# EAGLE design V1c (EAGLE 6.5.0)
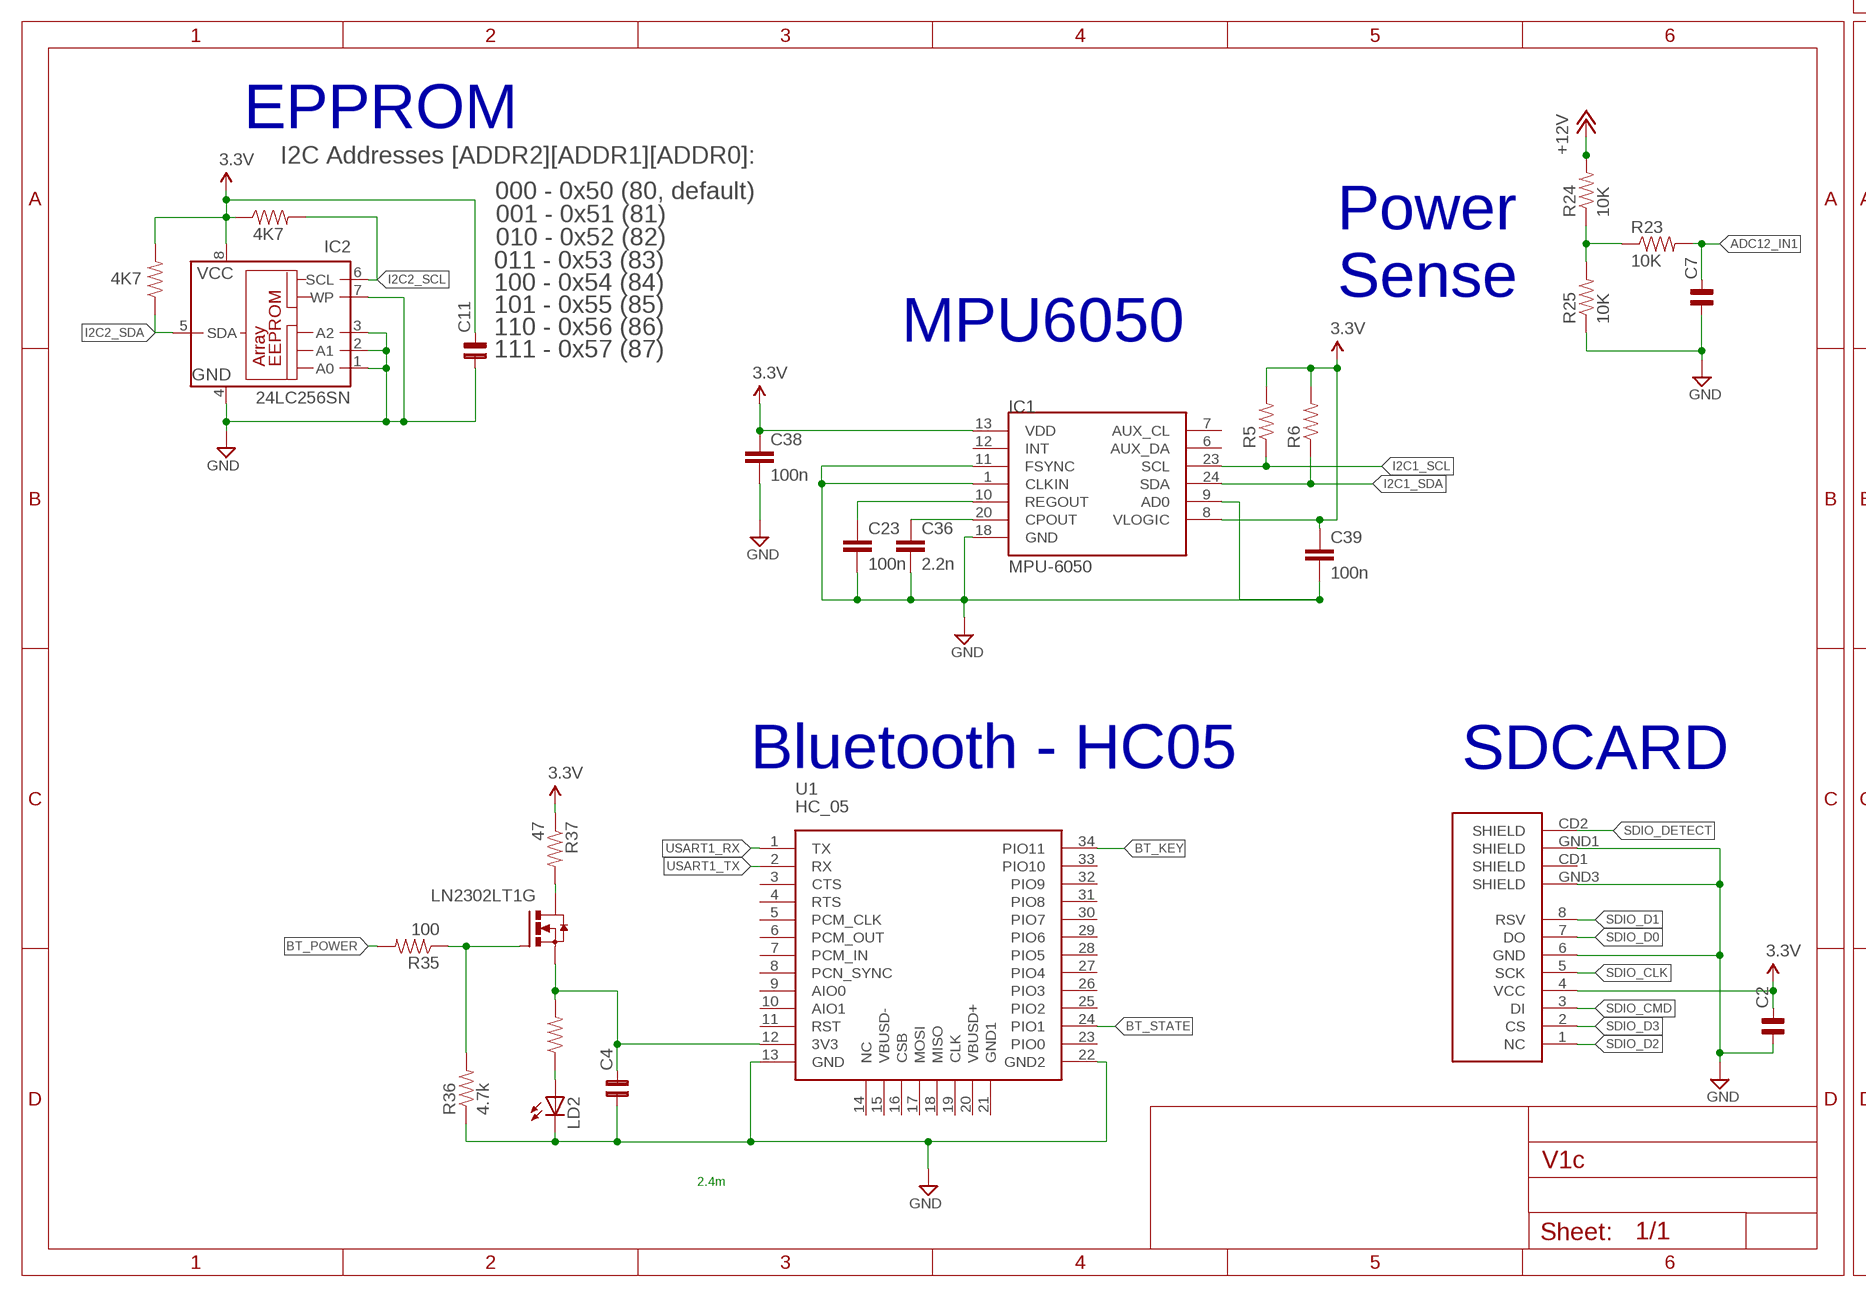
[diagram p0: schematic, sheet 1, part 1 of 2]
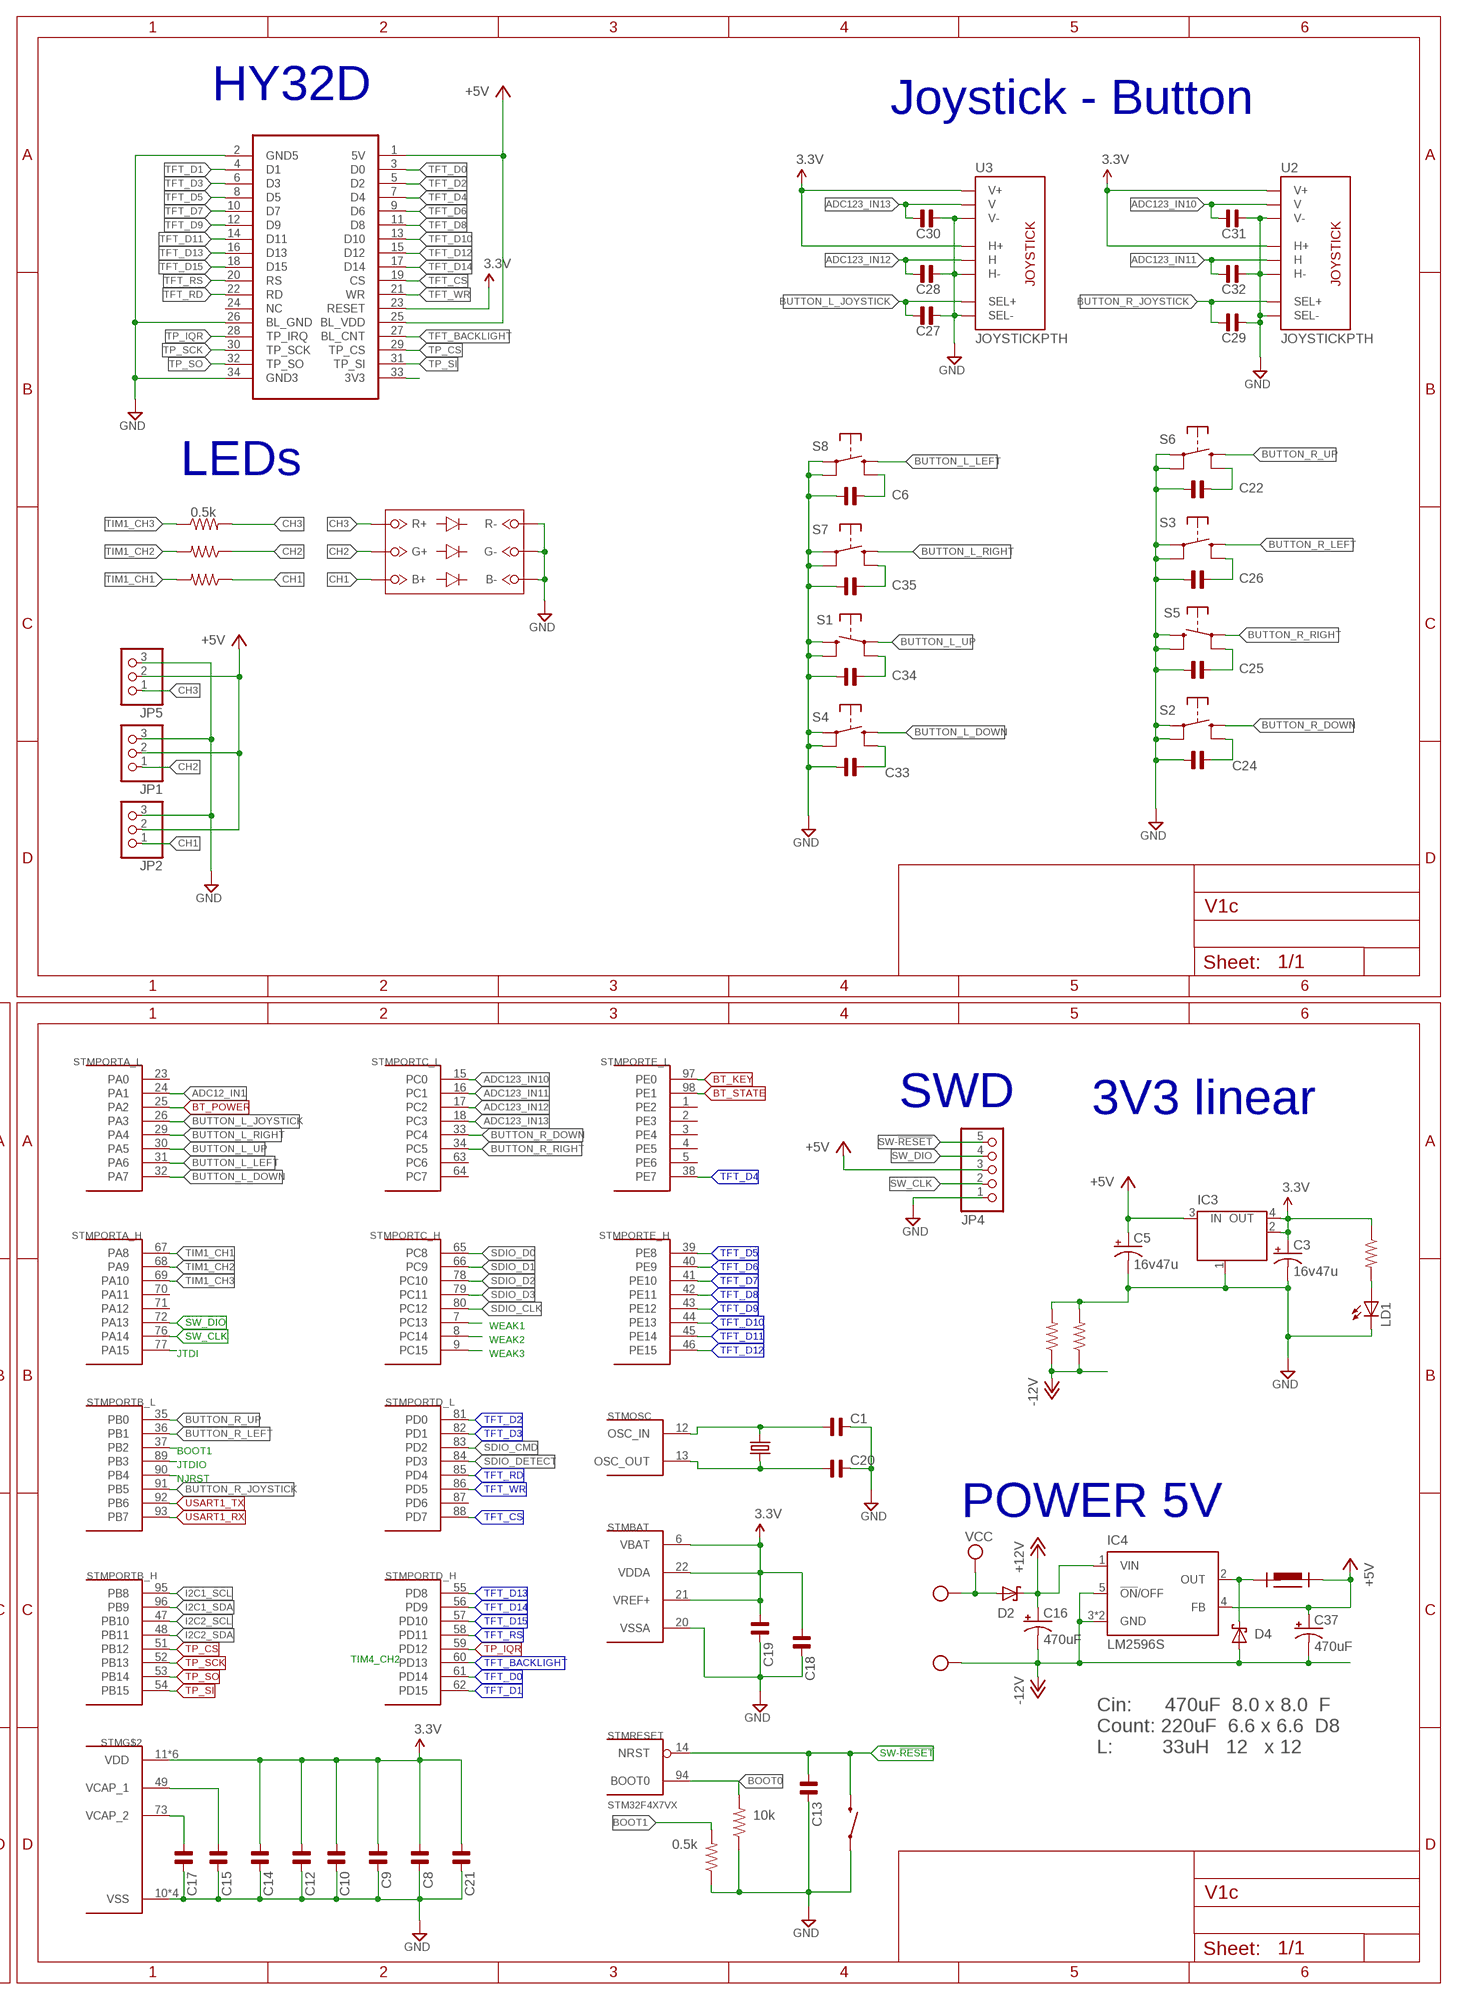
[diagram p1: schematic, sheet 1, part 2 of 2]

## Parts
C1  C-NP-SMD-0603  [C-0603]
C2  C-NP-SMD-0603  [C-0603]
C3  16v47u  CPOL-USSMCC  [SMC_C]
C4  C-NP-SMD-0603  [C-0603]
C5  16v47u  CPOL-USSMCC  [SMC_C]
C6  C-NP-SMD-0603  [C-0603]
C7  C-NP-SMD-0603  [C-0603]
C8  C-NP-SMD-0603  [C-0603]
C9  C-NP-SMD-0603  [C-0603]
C10  C-NP-SMD-0603  [C-0603]
C11  C-NP-SMD-0603  [C-0603]
C12  C-NP-SMD-0603  [C-0603]
C13  C-NP-SMD-0603  [C-0603]
C14  C-NP-SMD-0603  [C-0603]
C15  C-NP-SMD-0603  [C-0603]
C16  470uF  CPOL-US175TMP-0808  [175TMP-0808]
C17  C-NP-SMD-0603  [C-0603]
C18  C-NP-SMD-0603  [C-0603]
C19  C-NP-SMD-0603  [C-0603]
C20  C-NP-SMD-0603  [C-0603]
C21  C-NP-SMD-0603  [C-0603]
C22  C-NP-SMD-0603  [C-0603]
C23  100n  SPARKFUN_CAP0603-CAP  [SPARKFUN_0603-CAP]
C24  C-NP-SMD-0603  [C-0603]
C25  C-NP-SMD-0603  [C-0603]
C26  C-NP-SMD-0603  [C-0603]
C27  C-NP-SMD-0603  [C-0603]
C28  C-NP-SMD-0603  [C-0603]
C29  C-NP-SMD-0603  [C-0603]
C30  C-NP-SMD-0603  [C-0603]
C31  C-NP-SMD-0603  [C-0603]
C32  C-NP-SMD-0603  [C-0603]
C33  C-NP-SMD-0603  [C-0603]
C34  C-NP-SMD-0603  [C-0603]
C35  C-NP-SMD-0603  [C-0603]
C36  2.2n  SPARKFUN_CAP0603-CAP  [SPARKFUN_0603-CAP]
C37  470uF  CPOL-USE/7260-38W  [E/7260-38W]
C38  100n  SPARKFUN_CAP0603-CAP  [SPARKFUN_0603-CAP]
C39  100n  SPARKFUN_CAP0603-CAP  [SPARKFUN_0603-CAP]
D2  MBRS330T3  [SMC]
D4  MBRS330T3  [SMC]
IC1  MPU-6050  TESTING_MPU-6050-1  [TESTING_QFN-24-4MM2]
IC2  24LC256SN  [SO-08]
IC3  LINEAR_MC33269ST-3.3T3  [LINEAR_SOT223]
IC4  LM2596S  [TO263-5]
JP1  PINHD-1X3_2.54-90°  [1X03/90]
JP2  PINHD-1X3_2.54-90°  [1X03/90]
JP4  PINHD-1X5_2.54-90°  [1X05/90]
JP5  PINHD-1X3_2.54-90°  [1X03/90]
LD1  LEDCHIPLED_0805  [CHIPLED_0805]
LD2  LEDCHIPLED_0805  [CHIPLED_0805]
LN2302LT1G  FDN327N  [SOT-23]
R1  10k  SPARKFUN_RESISTOR0603-RES  [SPARKFUN_0603-RES]
R2  10k  SPARKFUN_RESISTOR0603-RES  [SPARKFUN_0603-RES]
R5  SPARKFUN_RESISTOR0603-RES  [SPARKFUN_0603-RES]
R6  SPARKFUN_RESISTOR0603-RES  [SPARKFUN_0603-RES]
R7  10k  SPARKFUN_RESISTOR0603-RES  [SPARKFUN_0603-RES]
R8  0.5k  SPARKFUN_RESISTOR0603-RES  [SPARKFUN_0603-RES]
R9  10K  SPARKFUN_RESISTOR0603-RES  [SPARKFUN_0603-RES]
R10  10K  SPARKFUN_RESISTOR0603-RES  [SPARKFUN_0603-RES]
R11  10K  SPARKFUN_RESISTOR0603-RES  [SPARKFUN_0603-RES]
R12  10K  SPARKFUN_RESISTOR0603-RES  [SPARKFUN_0603-RES]
R15  4K7  SPARKFUN_RESISTOR0603-RES  [SPARKFUN_0603-RES]
R16  4K7  SPARKFUN_RESISTOR0603-RES  [SPARKFUN_0603-RES]
R23  10K  SPARKFUN_RESISTOR0603-RES  [SPARKFUN_0603-RES]
R24  10K  SPARKFUN_RESISTOR0603-RES  [SPARKFUN_0603-RES]
R25  10K  SPARKFUN_RESISTOR0603-RES  [SPARKFUN_0603-RES]
R35  100  SPARKFUN_RESISTOR0603-RES  [SPARKFUN_0603-RES]
R36  4.7k  SPARKFUN_RESISTOR0603-RES  [SPARKFUN_0603-RES]
R37  47  SPARKFUN_RESISTOR0603-RES  [SPARKFUN_0603-RES]
R39  10K  SPARKFUN_RESISTOR0603-RES  [SPARKFUN_0603-RES]
S1  RACON12/  [RACON12/]
S2  RACON12/  [RACON12/]
S3  RACON12/  [RACON12/]
S4  RACON12/  [RACON12/]
S5  RACON12/  [RACON12/]
S6  RACON12/  [RACON12/]
S7  RACON12/  [RACON12/]
S8  RACON12/  [RACON12/]
S9  RESET  SWITCH-MOMENTARY-2-SMD-1101NE  [TACTILE-SWITCH-1101NE]
SDCARD2  microSD Socket  USD-SOCKETNEW  [MICRO-SD-SOCKET-PP]
STM  STM32F4X7VX  [TQFP100]
U1  HC_05  [BLUETOOTH_SMD]
U2  JOYSTICKPTH  [JOYSTICK]
U3  JOYSTICKPTH  [JOYSTICK]
U$3  TFT3.2  [HY32D_2]
U$5  BIG_INDUCTOR  [12X12]
U$13  RGB_LED  [SMD]
X1  MKDSN1,5/2-5,08  [MKDSN1,5/2-5,08]
Y1  CRYSTALHC49US  [HC49US]

## Nets
3.3V: C2.2 C3.+ C8.1 C9.1 C10.1 C11.2 C12.1 C14.1 C18.1 C19.1 C21.1 C38.1 C39.1 IC1.8(VLOGIC) IC1.13(VDD) IC2.8(VCC) IC3.2(OUT) IC3.4(OUT) R5.2 R6.2 R9.1 R15.1 R16.2 R37.1 SDCARD2.4(VCC) STM.6(BAT:VBAT) STM.11(VDD) STM.19(VDD) STM.21(BAT:VREF+) STM.22(BAT:VDDA) STM.28(VDD) STM.50(VDD) STM.75(VDD) STM.100(VDD) U2.H1(H+) U2.V1(V+) U3.H1(H+) U3.V1(V+) U$3.23(RESET)
+5V: C5.+ C37.+ IC3.3(IN) IC4.4(FB) JP1.2 JP2.2 JP4.3 JP5.2 U$3.1(5V) U$3.25(BL_VDD) U$5.P$1
+12V: C16.+ D2.C IC4.1(VIN) R24.2
-12V: C16.- C37.- D4.A IC4.3(GND) IC4.5(!ON!/OFF) IC4.6(GND) R1.1 R2.1 X1.1
ADC12_IN1: C7.2 R23.2 STM.24(PORTA_L:PA1)
ADC123_IN10: C31.1 STM.15(PORTC_L:PC0) U2.V2(V)
ADC123_IN11: C32.1 STM.16(PORTC_L:PC1) U2.H2(H)
ADC123_IN12: C28.1 STM.17(PORTC_L:PC2) U3.H2(H)
ADC123_IN13: C30.1 STM.18(PORTC_L:PC3) U3.V2(V)
BOOT0: R7.2 STM.94(RESET:BOOT0)
BOOT1: R8.2 STM.37(PORTB_L:PB2)
BT_KEY: STM.97(PORTE_L:PE0) U1.34(PIO11)
BT_POWER: R35.2 STM.25(PORTA_L:PA2)
BT_STATE: STM.98(PORTE_L:PE1) U1.24(PIO1)
BUTTON_L_DOWN: S4.1(S) STM.32(PORTA_L:PA7)
BUTTON_L_JOYSTICK: C27.1 STM.26(PORTA_L:PA3) U3.B1A(SEL+)
BUTTON_L_LEFT: S8.1(S) STM.31(PORTA_L:PA6)
BUTTON_L_RIGHT: S7.1(S) STM.29(PORTA_L:PA4)
BUTTON_L_UP: S1.3(P) STM.30(PORTA_L:PA5)
BUTTON_R_DOWN: S2.1(S) STM.33(PORTC_L:PC4)
BUTTON_R_JOYSTICK: C29.1 STM.91(PORTB_L:PB5) U2.B1A(SEL+)
BUTTON_R_LEFT: S3.1(S) STM.36(PORTB_L:PB1)
BUTTON_R_RIGHT: S5.3(P) STM.34(PORTC_L:PC5)
BUTTON_R_UP: S6.1(S) STM.35(PORTB_L:PB0)
CH1: JP2.1 R11.1 U$13.B+
CH2: JP1.1 R39.1 U$13.G+
CH3: JP5.1 R12.2 U$13.R+
GND: C1.2 C2.1 C3.- C4.1 C5.- C6.1 C7.1 C8.2 C9.2 C10.2 C11.1 C12.2 C13.2 C14.2 C15.2 C17.2 C18.2 C19.2 C20.2 C21.2 C22.1 C23.2 C24.2 C25.2 C26.2 C27.2 C28.2 C29.2 C30.2 C31.2 C32.2 C33.2 C34.2 C35.2 C36.2 C38.2 C39.2 IC1.1(CLKIN) IC1.9(AD0) IC1.11(FSYNC) IC1.18(GND) IC2.1(A0) IC2.2(A1) IC2.3(A2) IC2.4(GND) IC2.7(WP) IC3.1(GND/ADJ) JP1.3 JP2.3 JP4.1 JP5.3 LD1.C LD2.C R1.2 R2.2 R7.1 R8.1 R25.1 R36.1 S1.1(S) S1.2(S) S2.3(P) S2.4(P) S3.3(P) S3.4(P) S4.3(P) S4.4(P) S5.1(S) S5.2(S) S6.3(P) S6.4(P) S7.3(P) S7.4(P) S8.3(P) S8.4(P) S9.P$1 SDCARD2.6(GND) SDCARD2.GND1(SHIELD) SDCARD2.GND3(SHIELD) STM.10(VSS) STM.20(BAT:VSSA) STM.27(VSS) STM.74(VSS) STM.99(VSS) U1.13(GND) U1.22(GND2) U2.B2A(SEL-) U2.H3(H-) U2.V3(V-) U3.B2A(SEL-) U3.H3(H-) U3.V3(V-) U$3.2(GND5) U$3.26(BL_GND) U$3.34(GND3) U$13.B- U$13.G- U$13.R-
I2C1_SCL: IC1.23(SCL) R5.1 STM.95(PORTB_H:PB8)
I2C1_SDA: IC1.24(SDA) R6.1 STM.96(PORTB_H:PB9)
I2C2_SCL: IC2.6(SCL) R15.2 STM.47(PORTB_H:PB10)
I2C2_SDA: IC2.5(SDA) R16.1 STM.48(PORTB_H:PB11)
JTDI: STM.77(PORTA_H:PA15)
JTDIO: STM.89(PORTB_L:PB3)
N$1: C1.1 STM.12(OSC:OSC_IN) Y1.2
N$2: C6.2 S8.2(S)
N$3: C23.1 IC1.10(REGOUT)
N$4: C36.1 IC1.20(CPOUT)
N$5: C22.2 S6.2(S)
N$6: C35.1 S7.2(S)
N$7: C25.1 S5.4(P)
N$8: C4.2 LN2302LT1G.2(S) R10.2 U1.12(3V3)
N$9: C24.1 S2.2(S)
N$10: C26.1 S3.2(S)
N$11: LN2302LT1G.3(D) R37.2
N$12: C34.1 S1.4(P)
N$13: C33.1 S4.2(S)
N$14: LD1.A R9.2
N$15: LD2.A R10.1
N$27: R23.1 R24.1 R25.2
N$29: C20.1 STM.13(OSC:OSC_OUT) Y1.1
N$30: U$3.33(3V3)
N$31: C17.1 STM.73(VCAP_2)
N$32: C15.1 STM.49(VCAP_1)
N$34: LN2302LT1G.1(G) R35.1 R36.2
NJRST: STM.90(PORTB_L:PB4)
OUT1: D4.C IC4.2(OUT) U$5.P$2
SDIO_CLK: SDCARD2.5(SCK) STM.80(PORTC_H:PC12)
SDIO_CMD: SDCARD2.3(DI) STM.83(PORTD_L:PD2)
SDIO_D0: SDCARD2.7(DO) STM.65(PORTC_H:PC8)
SDIO_D1: SDCARD2.8(RSV) STM.66(PORTC_H:PC9)
SDIO_D2: SDCARD2.1(NC) STM.78(PORTC_H:PC10)
SDIO_D3: SDCARD2.2(CS) STM.79(PORTC_H:PC11)
SDIO_DETECT: SDCARD2.CD2(SHIELD) STM.84(PORTD_L:PD3)
SW-!RESET: C13.1 JP4.5 S9.P$2 STM.14(RESET:NRST)
SW_CLK: JP4.2 STM.76(PORTA_H:PA14)
SW_DIO: JP4.4 STM.72(PORTA_H:PA13)
TFT_BACKLIGHT: STM.60(PORTD_H:PD13) U$3.27(BL_CNT)
TFT_CS: STM.88(PORTD_L:PD7) U$3.19(CS)
TFT_D0: STM.61(PORTD_H:PD14) U$3.3(D0)
TFT_D1: STM.62(PORTD_H:PD15) U$3.4(D1)
TFT_D2: STM.81(PORTD_L:PD0) U$3.5(D2)
TFT_D3: STM.82(PORTD_L:PD1) U$3.6(D3)
TFT_D4: STM.38(PORTE_L:PE7) U$3.7(D4)
TFT_D5: STM.39(PORTE_H:PE8) U$3.8(D5)
TFT_D6: STM.40(PORTE_H:PE9) U$3.9(D6)
TFT_D7: STM.41(PORTE_H:PE10) U$3.10(D7)
TFT_D8: STM.42(PORTE_H:PE11) U$3.11(D8)
TFT_D9: STM.43(PORTE_H:PE12) U$3.12(D9)
TFT_D10: STM.44(PORTE_H:PE13) U$3.13(D10)
TFT_D11: STM.45(PORTE_H:PE14) U$3.14(D11)
TFT_D12: STM.46(PORTE_H:PE15) U$3.15(D12)
TFT_D13: STM.55(PORTD_H:PD8) U$3.16(D13)
TFT_D14: STM.56(PORTD_H:PD9) U$3.17(D14)
TFT_D15: STM.57(PORTD_H:PD10) U$3.18(D15)
TFT_RD: STM.85(PORTD_L:PD4) U$3.22(RD)
TFT_RS: STM.58(PORTD_H:PD11) U$3.20(RS)
TFT_WR: STM.86(PORTD_L:PD5) U$3.21(WR)
TIM1_CH1: R11.2 STM.67(PORTA_H:PA8)
TIM1_CH2: R39.2 STM.68(PORTA_H:PA9)
TIM1_CH3: R12.1 STM.69(PORTA_H:PA10)
TP_CS: STM.51(PORTB_H:PB12) U$3.29(TP_CS)
TP_IQR: STM.59(PORTD_H:PD12) U$3.28(TP_IRQ)
TP_SCK: STM.52(PORTB_H:PB13) U$3.30(TP_SCK)
TP_SI: STM.54(PORTB_H:PB15) U$3.31(TP_SI)
TP_SO: STM.53(PORTB_H:PB14) U$3.32(TP_SO)
USART1_RX: STM.93(PORTB_L:PB7) U1.1(TX)
USART1_TX: STM.92(PORTB_L:PB6) U1.2(RX)
VCC: D2.A X1.2
WEAK1: STM.7(PORTC_H:PC13)
WEAK2: STM.8(PORTC_H:PC14)
WEAK3: STM.9(PORTC_H:PC15)
Unconnected: IC1.6(AUX_DA) IC1.7(AUX_CL) IC1.12(INT) SDCARD2.CD1(SHIELD) STM.1(PORTE_L:PE2) STM.2(PORTE_L:PE3) STM.3(PORTE_L:PE4) STM.4(PORTE_L:PE5) STM.5(PORTE_L:PE6) STM.23(PORTA_L:PA0) STM.63(PORTC_L:PC6) STM.64(PORTC_L:PC7) STM.70(PORTA_H:PA11) STM.71(PORTA_H:PA12) STM.87(PORTD_L:PD6) U1.3(CTS) U1.4(RTS) U1.5(PCM_CLK) U1.6(PCM_OUT) U1.7(PCM_IN) U1.8(PCN_SYNC) U1.9(AIO0) U1.10(AIO1) U1.11(RST) U1.14(NC) U1.15(VBUSD-) U1.16(CSB) U1.17(MOSI) U1.18(MISO) U1.19(CLK) U1.20(VBUSD+) U1.21(GND1) U1.23(PIO0) U1.25(PIO2) U1.26(PIO3) U1.27(PIO4) U1.28(PIO5) U1.29(PIO6) U1.30(PIO7) U1.31(PIO8) U1.32(PIO9) U1.33(PIO10) U$3.24(NC)

## Notes on the sheet
- HY32D | Joystick - Button
- LEDs
- EPPROM
- SWD
- I2C Addresses [ADDR2][ADDR1][ADDR0]: | 3V3 linear
- 000 - 0x50 (80, default)
- 001 - 0x51 (81)
- 010 - 0x52 (82)
- 011 - 0x53 (83)
- 100 - 0x54 (84)
- Power
  Sense
- 101 - 0x55 (85)
- 110 - 0x56 (86) | MPU6050
- 111 - 0x57 (87)
- POWER 5V
- SDCARD
- Bluetooth - HC05
- TIM4_CH2
- Cin:      470uF  8.0 x 8.0  F
  Count: 220uF  6.6 x 6.6  D8
  L:         33uH   12   x 12
- 2.4m
- TJA1040

## Library data of the parts
C1 C2 C4 C6-C15 C17-C22 C24-C35 = cap-pan40:C-NP: NON-POLARIZED FILM/CHIP
C3 C5 = rcl:CPOL-US: POLARIZED CAPACITOR, American symbol
C16 C37 = adafruit:CPOL-US: POLARIZED CAPACITOR, American symbol
C23 C36 C38 C39 = Helios_RLC:SPARKFUN_CAP: Capacitor Standard 0603 ceramic capacitor, and 0.1" leaded capacitor.
D2 D4 = Robotech Diode of Chung:MBRS3*0T3: SCHOTTKY BARRIER RECTIFIER 3.0 AMPERES 20, 30, 40 VOLT Source: MBRS340T3-D.pdf
IC1 = Helios_IMU:TESTING_MPU-6050
IC2 = microchip:24*: Serial EEPROM I2C; DIGIKEY: 24LC256-E/SN-ND; MF: MICROCHIP; MPN: 24LC256-I/SN; OC_FARNELL: 9757996; OC_NEWARK: 27C9144
IC3 = Robotech_Other:LINEAR_MC33269ST*: Adjustable Output Low Dropout Voltage Regulator 800 mA Source: http://www.onsemi.com/pub/Collateral/MC33269-D.PDF
IC4 = national-semiconductor:LM2596: SIMPLE SWITCHER® Power Converter 150 kHz 3A Step-Down Voltage Regulator Source: http://www.national.com/ds/LM/LM2596.pdf; MF: NATIONAL SEMICONDUCTOR; MPN: LM2596S-ADJ/NOPB; OC_FARNELL: 9494367; OC_NEWARK: 41K3842
JP1 JP2 JP5 = pinhead-1:PINHD-1X3: PIN HEADER
JP4 = pinhead-1:PINHD-1X5: PIN HEADER
LD1 LD2 = led:LED: LED OSRAM: - CHIPLED LG R971, LG N971, LY N971, LG Q971, LY Q971, LO R971, LY R971 LH N974, LH R974 LS Q976, LO Q976, LY Q976 LO Q996 - Hyper CHIPLED LW Q18S LB Q993, LB Q99A, LB R99A - SideLED LS A670, LO A670, LY A670, LG A670, LP A670 LB A673, LV A673, LT A673, LW A673 LH A674 LY A675 LS A676, LA A676, LO A676, LY A676, LW A676 LS A679, LY A679, LG A679 - Hyper Micro SIDELED® LS Y876, LA Y876, LO Y876, LY Y876 LT Y87S - SmartLED LW L88C, LW L88S LB L89C, LB L89S, LG L890 LS L89K, LO L89K, LY L89K LS L896, LA L896, LO L896, LY L896 - TOPLED LS T670, LO T670, LY T670, LG T670, LP T670 LSG T670, LSP T670, LSY T670, LOP T670, LYG T670 LG T671, LOG T671, LSG T671 LB T673, LV T673, LT T673, LW T673 LH T674 LS T676, LA T676, LO T676, LY T676, LB T676, LH T676, LSB T676, LW T676 LB T67C, LV T67C, LT T67C, LS T67K, LO T67K, LY T67K, LW E67C LS E67B, LA E67B, LO E67B, LY E67B, LB E67C, LV E67C, LT E67C LW T67C LS T679, LY T679, LG T679 LS T770, LO T770, LY T770, LG T770, LP T770 LB T773, LV T773, LT T773, LW T773 LH T774 LS E675, LA E675, LY E675, LS T675 LS T776, LA T776, LO T776, LY T776, LB T776 LHGB T686 LT T68C, LB T68C - Hyper Mini TOPLED® LB M676 - Mini TOPLED Santana® LG M470 LS M47K, LO M47K, LY M47K Source: http://www.osram.convergy.de/
LN2302LT1G = TESTWORK_PIM_PIC32MX795F512L:FDN327N
R1 R2 R7-R11 R15 R16 R23-R25 R39 = Robotech_RCL:SPARKFUN_RESISTOR: Resistor Basic schematic elements and footprints for 0603, 1206, and PTH resistors.
R5 R6 = Helios_RLC:SPARKFUN_RESISTOR: Resistor Basic schematic elements and footprints for 0603, 1206, and PTH resistors.
R12 = Robotech_RCL:SPARKFUN_RESISTOR: Resistor Basic schematic elements and footprints for 0603, 1206, and PTH resistors.; R32: 0.5k
R35-R37 = HMC5883L_Breakout-v11:SPARKFUN_RESISTOR: Resistor Basic schematic elements and footprints for 0603, 1206, and PTH resistors.
S1-S8 = switch-misc:RACON12: ITT SWITCH
S9 = pixhawk2:SWITCH-MOMENTARY-2; PARTNO: EVQ-P7J01P
SDCARD2 = SparkFun:USD-SOCKET: microSD Socket Push-push type uSD socket. Schematic element and footprint production proven. Spark Fun Electronics SKU : PRT-00127. tDoc lines correctly indicate media card edge positions when inserting (unlocked, locked, depressed).
STM = pixhawk2:STM32F4X7VX: STM32F4X7VX 100 pin LQFP STM32F407VE - 512 KB flash, no crypto STM32F407VG - 1 MB flash, no crypto STM32F417VE - 512 KB flash, with crypto STM32F417VG - 1 MB flash, with crypto; PARTNO: STM32F427VI
U1 = SerialPortBluetooth:HC_05
U2 U3 = SparkFun:JOYSTICK: Thumb Joystick Joystick commonly found in PS2 controllers. Two pots and a select switch. Footprint proven. Spark Fun Electronics SKU : COM-09032
U$3 = TFT:TFT3.2
U$5 = Big_inductor:BIG_INDUCTOR
U$13 = RGB_LED:RGB_LED
X1 = con-phoenix-508:MKDSN1,5/2-5,08: MKDSN 1,5/ 2-5,08 Printklemme Nennstrom: 13,5 A Nennspannung: 250 V Rastermaß: 5,08 mm Polzahl: 2 Anschlussart: Schraubanschluss Montage: Löten Anschlussrichtung Leiter/Platine: 0 ° Artikelnummer: 1729128 Source: http://eshop.phoenixcontact.com .. 1729128.pdf; MPN: MKDSN 1,5/2-5.08; OC_FARNELL: 1792903; OC_NEWARK: 30M2397
Y1 = SparkFun-FreqCtrl:CRYSTAL: Various standard crystals. Proven footprints. Spark Fun Electronics SKU : COM-00534

## Net classes
1 power: width 0.15 mm, drill 0.2 mm, clearance 0.152 mm

## Board
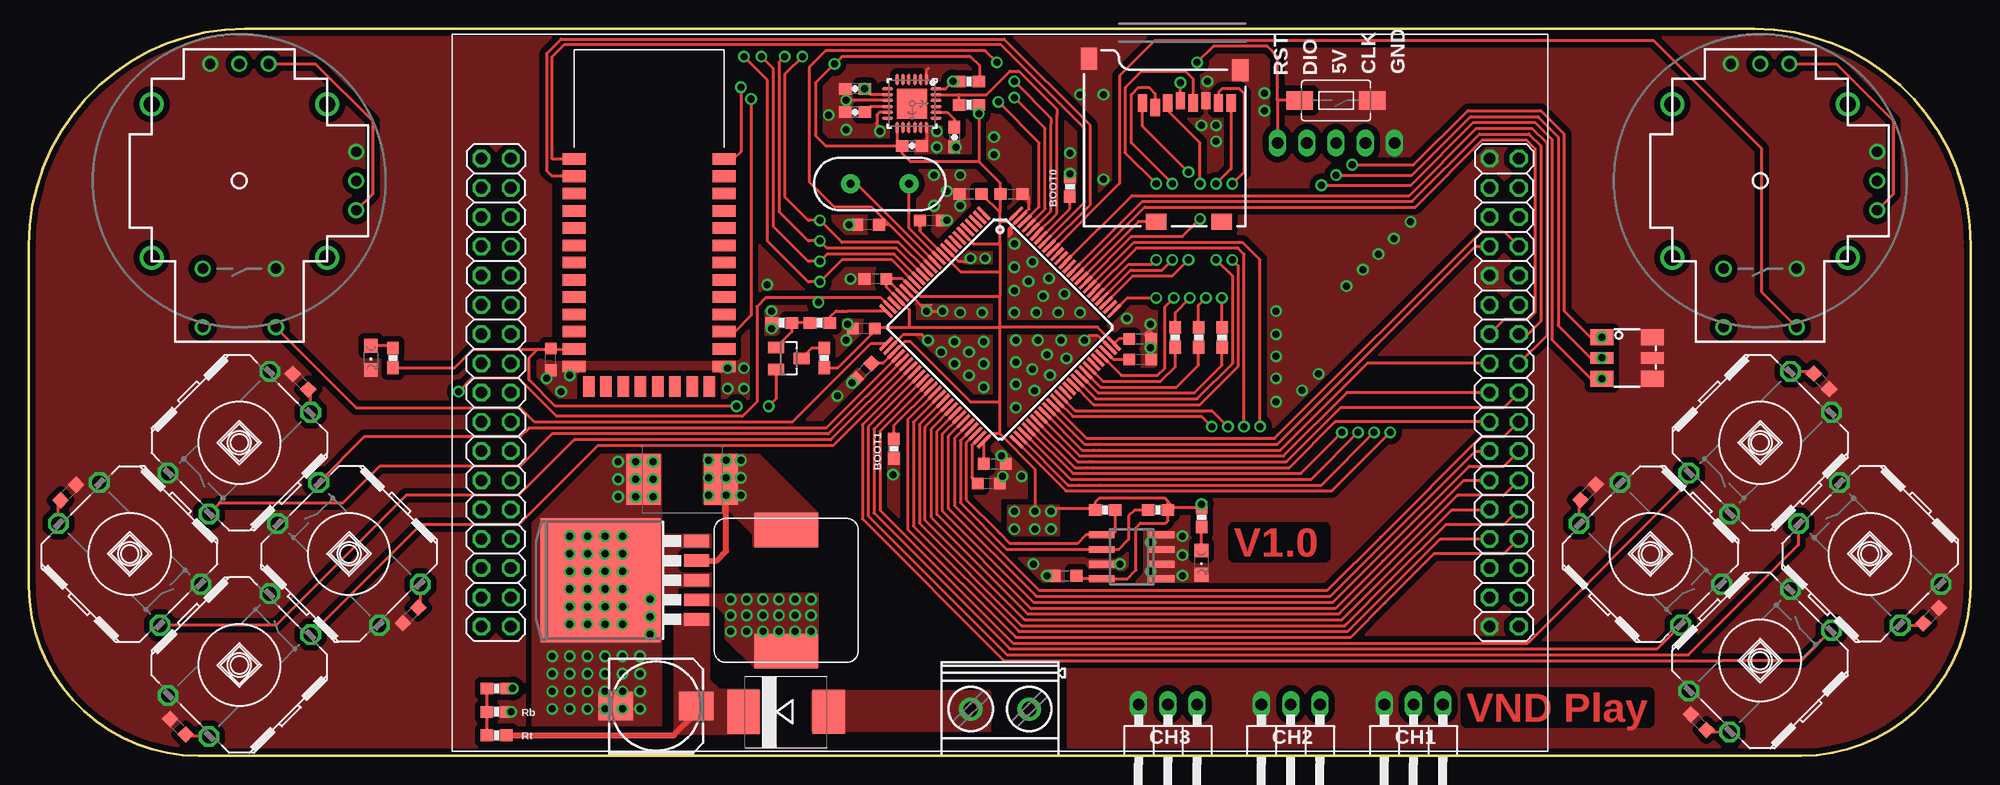
[diagram p2: board, top side]
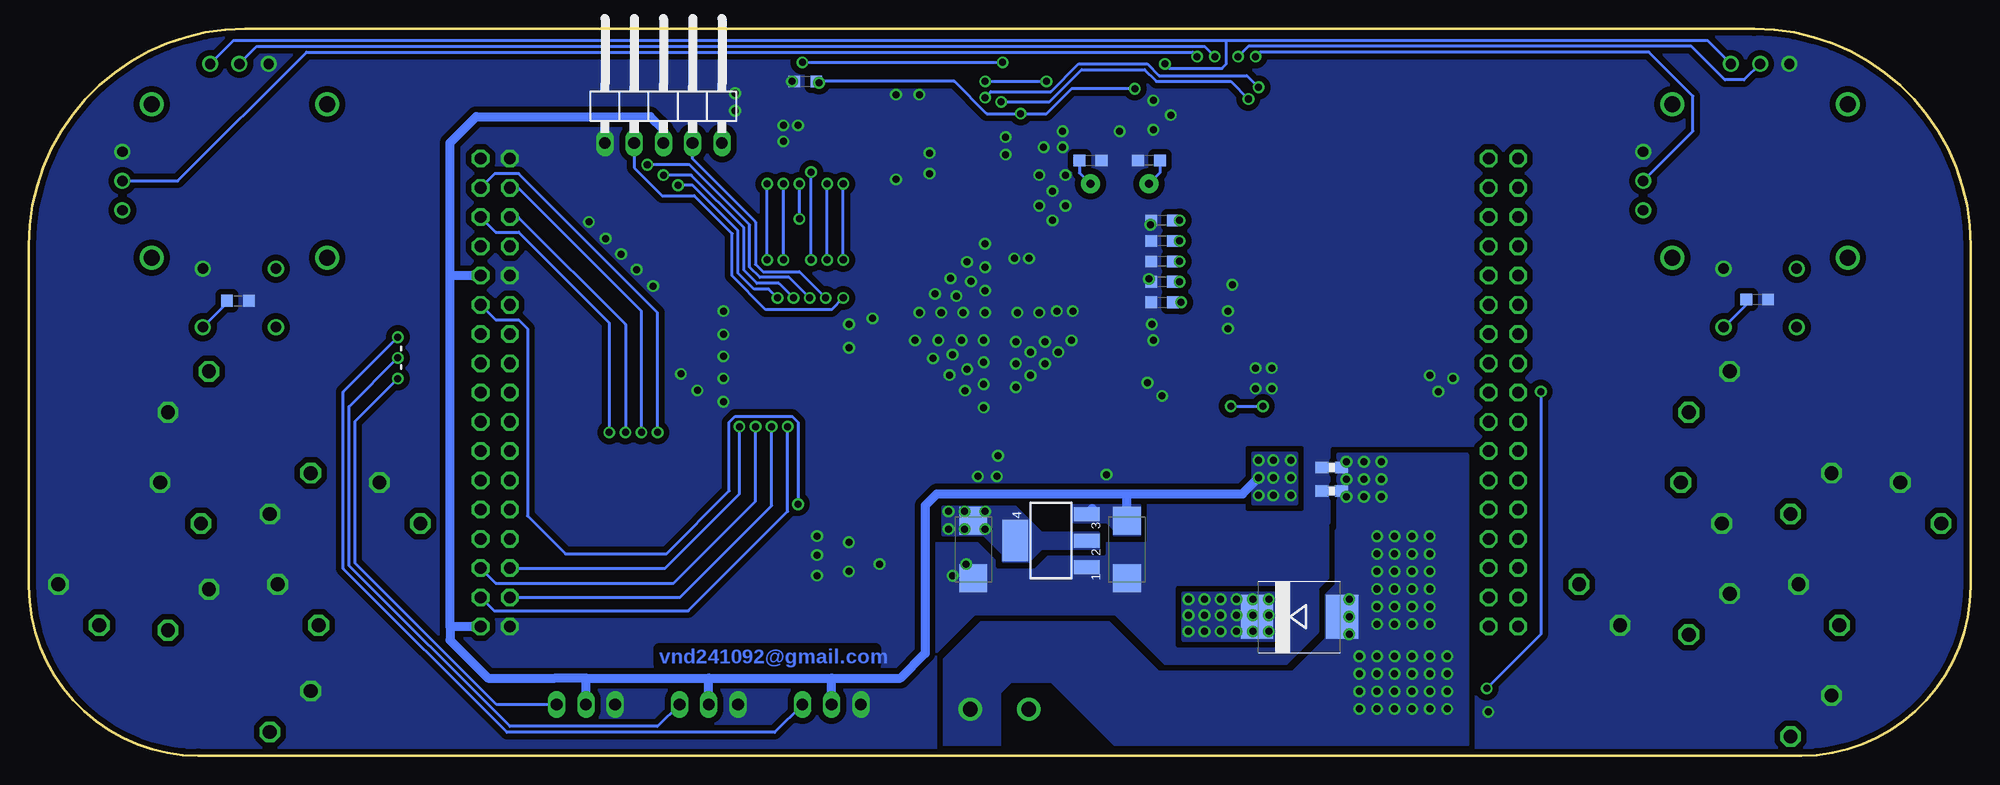
[diagram p3: board, bottom side, seen from below]

Size 168.66 x 63.12 mm. Coordinates in mm from the lower left corner, seen from the top.
Outline: 168.66,44.32 168.66,14.73 arc-90 153.92,0 14.73,0 arc-90 0,14.73 0,44.32 arc-90 18.8,63.12 149.86,63.12 arc-90 168.66,44.32
Copper layers (1*16): Top 0.035mm / dielectric 1.5mm / Bottom 0.035mm
Design rules "default *": minimum track width 10mil, minimum drill 24mil, track to track 8mil, track to pad 8mil, pad to pad 8mil, via to via 10mil, smd to smd 8mil, copper to edge 20mil, drill to drill 10mil, minimum pad ring 10mil, minimum via ring 8mil, stop-mask expansion 0mil, vias tented up to drill 100mil, thermal gap 10mil

### Footprints (pad centres in the part's own frame; a part is rotated, then mirrored left to right if it is on the bottom)
C-0603 = smd 1.016 x 1.016: 1 -0.953,0; 2 0.953,0
SMC_C = smd 2.4 x 2.4: + -2.5,0; - 2.5,0
175TMP-0808 = smd 3 x 2.5: + 3.5,0; - -3.5,0
SPARKFUN_0603-CAP = smd 1.1 x 1: 1 -0.85,0; 2 0.85,0
E/7260-38W = smd 2.95 x 4.4: + 3.375,0; - -3.375,0
SMC = smd 2.8 x 3.8: A 3.7,0; C -3.7,0
TESTING_QFN-24-4MM2 = smd 1.016 x 0.254: 1 -2.066,1.257; 2 -2.066,0.75; 3 -2.066,0.247; 4 -2.066,-0.287; 5 -2.066,-0.792; 6 -2.066,-1.297; 13 2.086,-1.297; 14 2.086,-0.792; 15 2.086,-0.287; 16 2.086,0.247; 17 2.086,0.75; 18 2.086,1.257 | smd 0.254 x 1.016: 7 -1.267,-2.122; 8 -0.762,-2.122; 9 -0.258,-2.122; 10 0.278,-2.122; 11 0.78,-2.122; 12 1.287,-2.122; 19 1.287,2.082; 20 0.78,2.082; 21 0.278,2.082; 22 -0.258,2.082; 23 -0.762,2.082; 24 -1.267,2.082 | smd 2.616 x 2.616: P$1 0.02,-0.01
SO-08 = smd 0.6 x 2.2: 1 -1.905,-2.6; 2 -0.635,-2.6; 3 0.635,-2.6; 4 1.905,-2.6; 5 1.905,2.6; 6 0.635,2.6; 7 -0.635,2.6; 8 -1.905,2.6
LINEAR_SOT223 = smd 1.219 x 2.235: 1 -2.311,-3.099; 2 0,-3.099; 3 2.311,-3.099 | smd 3.6 x 2.2: 4 0,3.099
TO263-5 = smd 1.067 x 2.159: 1 -3.404,-5.791; 2 -1.702,-5.791; 3 0,-5.791; 4 1.702,-5.791; 5 3.404,-5.791 | smd 10.8 x 10.41: 6 0,2.54
1X03/90 = drill 1.016 long: 1 -2.54,-3.81; 2 0,-3.81; 3 2.54,-3.81
1X05/90 = drill 1.016 long: 1 -5.08,-3.81; 2 -2.54,-3.81; 3 0,-3.81; 4 2.54,-3.81; 5 5.08,-3.81
CHIPLED_0805 = smd 1.2 x 1.2: A 0,-1.05; C 0,1.05
SOT-23 = smd 1 x 1.4: 1 -0.91,-1.14; 2 0.99,-1.14; 3 0.04,1.06
SPARKFUN_0603-RES = smd 1.1 x 1: 1 -0.85,0; 2 0.85,0
RACON12/ = drill 1.194 octagon: 1 -6.198,-2.642; 2 2.642,6.198; 3 -2.642,-6.198; 4 6.198,2.642
TACTILE-SWITCH-1101NE = smd 2.3 x 1.6: P$1 -3.15,0; P$2 3.15,0
MICRO-SD-SOCKET-PP = smd 0.8 x 1.5: 1 -8.94,10.7; 2 -7.84,10.3; 3 -6.74,10.7; 4 -5.64,10.9; 5 -4.54,10.7; 6 -3.44,10.9; 7 -2.34,10.7; 8 -1.24,10.7 | smd 1.8 x 1.4: CD1 -2.05,0.4; CD2 -7.75,0.4 | smd 1.4 x 1.9: GND1 -13.6,14.55; GND3 -0.45,13.55
TQFP100 = smd 1.5 x 0.29: 1 -8,6; 2 -8,5.5; 3 -8,5; 4 -8,4.5; 5 -8,4; 6 -8,3.5; 7 -8,3; 8 -8,2.5; 9 -8,2; 10 -8,1.5; 11 -8,1; 12 -8,0.5; 13 -8,0; 14 -8,-0.5; 15 -8,-1; 16 -8,-1.5; 17 -8,-2; 18 -8,-2.5; 19 -8,-3; 20 -8,-3.5; 21 -8,-4; 22 -8,-4.5; 23 -8,-5; 24 -8,-5.5; 25 -8,-6; 51 8,-6; 52 8,-5.5; 53 8,-5; 54 8,-4.5; 55 8,-4; 56 8,-3.5; 57 8,-3; 58 8,-2.5; 59 8,-2; 60 8,-1.5; 61 8,-1; 62 8,-0.5; 63 8,0; 64 8,0.5; 65 8,1; 66 8,1.5; 67 8,2; 68 8,2.5; 69 8,3; 70 8,3.5; 71 8,4; 72 8,4.5; 73 8,5; 74 8,5.5; 75 8,6 | smd 0.29 x 1.5: 26 -6,-8; 27 -5.5,-8; 28 -5,-8; 29 -4.5,-8; 30 -4,-8; 31 -3.5,-8; 32 -3,-8; 33 -2.5,-8; 34 -2,-8; 35 -1.5,-8; 36 -1,-8; 37 -0.5,-8; 38 0,-8; 39 0.5,-8; 40 1,-8; 41 1.5,-8; 42 2,-8; 43 2.5,-8; 44 3,-8; 45 3.5,-8; 46 4,-8; 47 4.5,-8; 48 5,-8; 49 5.5,-8; 50 6,-8; 76 6,8; 77 5.5,8; 78 5,8; 79 4.5,8; 80 4,8; 81 3.5,8; 82 3,8; 83 2.5,8; 84 2,8; 85 1.5,8; 86 1,8; 87 0.5,8; 88 0,8; 89 -0.5,8; 90 -1,8; 91 -1.5,8; 92 -2,8; 93 -2.5,8; 94 -3,8; 95 -3.5,8; 96 -4,8; 97 -4.5,8; 98 -5,8; 99 -5.5,8; 100 -6,8
BLUETOOTH_SMD = smd 2 x 1: 1 0,0; 2 0,-1.5; 3 0,-3; 4 0,-4.5; 5 0,-6; 6 0,-7.5; 7 0,-9; 8 0,-10.5; 9 0,-12; 10 0,-13.5; 11 0,-15; 12 0,-16.5; 13 0,-18; 22 13,-18; 23 13,-16.5; 24 13,-15; 25 13,-13.5; 26 13,-12; 27 13,-10.5; 28 13,-9; 29 13,-7.5; 30 13,-6; 31 13,-4.5; 32 13,-3; 33 13,-1.5; 34 13,0 | smd 1 x 1.8: 14 1.25,-19.75; 15 2.75,-19.75; 16 4.25,-19.75; 17 5.75,-19.75; 18 7.25,-19.75; 19 8.75,-19.75; 20 10.25,-19.75; 21 11.75,-19.75
JOYSTICK = drill 0.9: B1A -3.175,12.7; B1B 3.175,12.7; B2A -3.175,7.62; B2B 3.175,7.62 | drill 0.889: H1 -2.54,-10.16; H2 0,-10.16; H3 2.54,-10.16; V1 -10.16,2.54; V2 -10.16,0; V3 -10.16,-2.54 | drill 1.397: MOUNT1 -7.62,6.668; MOUNT2 -7.62,-6.668; MOUNT3 7.62,-6.668; MOUNT4 7.62,6.668
HY32D_2 = drill 1.016 octagon: 1 -0.6,-89.28; 2 -0.6,-86.74; 3 1.94,-89.28; 4 1.94,-86.74; 5 4.48,-89.28; 6 4.48,-86.74; 7 7.02,-89.28; 8 7.02,-86.74; 9 9.56,-89.28; 10 9.56,-86.74; 11 12.1,-89.28; 12 12.1,-86.74; 13 14.64,-89.28; 14 14.64,-86.74; 15 17.18,-89.28; 16 17.18,-86.74; 17 19.72,-89.28; 18 19.72,-86.74; 19 22.26,-89.28; 20 22.26,-86.74; 21 24.8,-89.28; 22 24.8,-86.74; 23 27.34,-89.28; 24 27.34,-86.74; 25 29.88,-89.28; 26 29.88,-86.74; 27 32.42,-89.28; 28 32.42,-86.74; 29 34.96,-89.28; 30 34.96,-86.74; 31 37.5,-89.28; 32 37.5,-86.74; 33 40.04,-89.28; 34 40.04,-86.74; 103 -0.6,-1.72; 104 -0.6,0.82; 105 1.94,-1.72; 106 1.94,0.82; 107 4.48,-1.72; 108 4.48,0.82; 109 7.02,-1.72; 110 7.02,0.82; 111 9.56,-1.72; 112 9.56,0.82; 113 12.1,-1.72; 114 12.1,0.82; 115 14.64,-1.72; 116 14.64,0.82; 117 17.18,-1.72; 118 17.18,0.82; 119 19.72,-1.72; 120 19.72,0.82; 121 22.26,-1.72; 122 22.26,0.82; 123 24.8,-1.72; 124 24.8,0.82; 125 27.34,-1.72; 126 27.34,0.82; 127 29.88,-1.72; 128 29.88,0.82; 129 32.42,-1.72; 130 32.42,0.82; 131 34.96,-1.72; 132 34.96,0.82; 133 37.5,-1.72; 134 37.5,0.82; 135 40.04,-1.72; 136 40.04,0.82
12X12 = smd 3 x 5.5: P$1 5,-0.25; P$2 -5.5,-0.25
SMD = smd 1.99 x 1.4: B+ -2.2,-1.8; B- 2.2,-1.8; R+ -2.2,1.8; R- 2.2,1.8 | smd 1.99 x 1: G+ -2.2,0; G- 2.2,0
MKDSN1,5/2-5,08 = drill 1.3 pad 2: 1 -2.561,0.025; 2 2.519,0.025
HC49US = drill 0.7 pad 1.651: 1 -2.54,0; 2 2.54,0

### Placement (x,y rotation side)
C1  76.45,51.69 0 bottom
C2  101.22,58.55 0 bottom
C3  86.61,17.91 270 bottom
C4  45.34,34.42 90 top
C5  73.28,17.91 270 bottom
C6  3.44,22.86 225 top
C7  70.23,39.37 0 bottom
C8  72.52,37.08 180 top
C9  78.36,46.48 0 top
C10  81.79,48.77 180 top
C11  90.04,15.62 0 top
C12  85.34,48.77 0 top
C13  72.9,46.1 180 top
C14  72.52,33.4 225 top
C15  83.36,23.65 0 top
C16  54.48,4.32 0 top
C17  96.52,34.42 0 top
C18  83.89,25.35 0 top
C19  96.52,36.2 0 top
C20  71.37,51.69 180 bottom
C21  73.53,41.4 180 top
C22  135.44,22.89 225 top
C23  71.76,55.88 180 top
C24  145.03,2.92 135 top
C25  165.22,12.16 45 top
C26  155.7,32.51 315 top
C27  18.54,39.62 0 bottom
C28  70.23,42.93 180 bottom
C29  150.5,39.5 0 bottom
C30  70.23,41.15 180 bottom
C31  70.23,46.48 180 bottom
C32  70.23,44.7 180 bottom
C33  12.94,2.52 135 top
C34  23.59,32.49 135 top
C35  33.15,12.19 225 top
C36  80.39,53.72 270 top
C37  56.77,24 0 top
C38  76.71,52.96 0 top
C39  71.76,57.91 180 top
D2  65.79,3.81 0 top
D4  58.29,12.06 0 bottom
IC1  76.71,56.64 270 top
IC2  95.78,17.27 90 top
IC3  79.88,18.67 90 bottom
IC4  52.2,15.24 90 top
JP1  109.6,0.64 180 top
JP2  120.27,0.64 180 top
JP4  113.54,57.02 0 bottom
JP5  98.93,0.64 180 top
LD1  101.85,16.76 180 top
LD2  29.72,34.54 180 top
LN2302LT1G  66.04,34.54 270 top
R1  55.5,22.99 180 bottom
R2  55.5,25.02 180 bottom
R5  81.66,56.52 0 top
R6  81.66,58.55 0 top
R7  90.42,49.4 270 top
R8  75.12,26.65 90 top
R9  101.85,20.7 270 top
R10  31.62,34.54 270 top
R11  103.63,36.32 270 top
R12  99.57,36.32 90 top
R15  98.07,21.33 180 top
R16  93.5,21.33 180 top
R23  40.64,5.84 0 top
R24  40.64,1.78 0 top
R25  40.64,3.81 180 top
R35  68.71,37.59 0 top
R36  65.41,37.59 0 top
R37  69.09,34.54 90 top
R39  101.6,36.32 270 top
S1  18.29,27.18 0 top
S2  150.37,8.25 180 top
S3  150.37,27.18 0 top
S4  18.29,7.87 180 top
S5  159.89,17.53 270 top
S6  140.84,17.53 90 top
S7  27.81,17.53 270 top
S8  8.76,17.53 90 top
S9  113.54,56.9 180 top
SDCARD2  105.66,45.97 0 top
STM  84.36,37.19 315 top
U1  47.37,51.82 0 top
U2  150.37,49.91 180 top
U3  18.29,49.91 180 top
U$3  40.13,11.81 90 top
U$5  65.53,14.61 90 top
U$13  138.81,34.54 0 top
X1  84.33,4.06 180 top
Y1  73.91,49.66 0 top

### Tracks (layer width: path | path; a pad name or v marks a point on that pad's centre or on a via)
3.3V  (via drill 0.61)
  Top 0.254: 98.96,21.3 98.96,20.45 98.7,20.19 96.54,20.19 96.16,19.81 96.16,16.13 95.4,15.37 IC2.8 91.25,15.37 C11.2 | 98.96,21.3 R15.1 99.05,21.21 | 77.41,45.55 C9.1 | 98.96,21.3 98.96,22.07 | 98.96,22.07 98.68,22.35 92.96,22.35 92.65,22.03 92.65,21.46 | 84.33,27.94 84.33,30.73 | 84.33,30.73 84.33,37.21 | 84.33,27.94 83.59,27.94 STM.50 82.94,27.28 C18.1 | 84.33,37.21 84.33,39.88 | 92.82,37.21 | 92.82,37.21 84.33,37.21 | 84.33,44.45 84.33,42.04 | 84.33,42.04 84.33,39.88 | 76.45,37.21 84.33,37.21 | 84.33,30.73 81.79,30.73 76.58,35.94 76.04,35.94 STM.28 74.17,34.07 C14.1 | 84.33,39.88 77.43,39.88 STM.19 75.9,41.4 74.68,41.4 | 84.33,42.04 80.92,42.04 STM.11 77.41,45.55 | C9.1 77.41,45.55 | 74.68,41.53 74.68,41.4 | 74.68,41.4 74.68,41.21 74.61,41.28 | STM.6 82.05,44.45 84.33,44.45 | 92.82,37.21 STM.75 94.68,36.2 C19.1 | IC1.13 75.41,52.96 | 75.41,52.96 75.41,52.83 75.86,52.83 C38.1 75.82,52.92 75.82,52.32 76.58,51.56 82.51,51.56 | 77.47,46.54 C9.1 | 84.33,44.45 84.33,46.35 | 84.33,46.35 84.33,47.18 | STM.100 85.04,46.35 84.33,46.35 | R6.2 82.55,58.59 82.55,59.94 81.79,60.71 70.61,60.71 v69.98,60.07 68.33,58.42 68.33,53.85 69.22,52.96 75.41,52.96 | 82.51,51.56 v82.51,55.75 R5.2 | SDCARD2.4 v100.02,58.43 | R37.1 70.27,33.69 73.66,37.08 | 76.45,37.21 76.45,38.73 STM.22 74.48,40.7 C21.1 STM.21 | C10.1 84.33,47.18 | C12.1 84.33,48.7 | 84.33,48.7 84.33,47.18 | 82.51,51.56 84.33,49.74 84.33,48.7 | 76.45,37.21 73.79,37.21 73.66,37.08 | 73.66,37.08 C8.1 | IC1.8 | IC1.8 73.11,57.4 C39.1 | v101.85,21.84 101.69,21.68 101.73,21.68 R9.1 99.48,21.55 98.96,22.07 | R16.2 92.65,21.46 | 84.33,27.94 87.38,24.89 87.38,21.34 | 92.65,21.46 89.03,21.46 v88.77,21.21
  Top 0.254: U2.H1 156.97,60.07 161.92,55.12 161.92,48.77 U2.V1 | U3.H1 24.89,60.07 29.85,55.12 29.85,48.77 U3.V1
  Bottom 0.254: U$3.23 128.11,37.85 126.11,37.85 125.35,37.08 125.35,20.83 122.05,17.53 113.28,17.53 107.82,22.99 107.82,28.96 107.31,29.46 102.36,29.46 101.85,28.96 v101.85,21.84 | U2.H1 150.88,62.1 64.64,62.1 | 64.64,62.1 22.86,62.1 U3.H1 | 64.64,62.1 64.64,60.07 65.02,59.69 69.6,59.69 v69.98,60.07 | C39.1 78.11,57.91 80.26,55.75 v82.51,55.75 85.47,55.75 88.27,58.55 C2.2 100.14,58.55 v100.02,58.43
  other vias: 72.61,57.91 85.6,21.21 87.38,21.21 87.38,19.69 85.6,19.69 88.77,19.69
  pour Bottom (isolate 0.508, no thermals): 80.65,19.3 82.93,21.59 89.28,21.59 89.28,19.18 85.73,19.18 84.07,17.53 84.07,16.89 81.79,16.89 80.65,18.03 75.69,18.03 75.69,19.3
  pour Top (isolate 0.508, rank 5, no thermals): 85.09,19.05 85.09,21.72 89.41,21.72 89.41,19.05
+5V  (via drill 0.61)
  Top 0.508: IC4.4 59.74,16.94 60.58,17.78 v60.58,22.61
  Bottom 0.762: IC3.3 76.3,21.46 | 132.08,11.21 132.08,41.69 | 132.08,41.69 132.08,53.21 129.79,55.5 114.68,55.5 113.54,54.36 JP4.3 | U$3.25 132.08,41.69 | U$3.1 132.08,11.21 | 73.28,22.73 89.79,22.73 90.81,21.72 90.81,8.89 92.96,6.73 98.93,6.73 | 73.28,22.73 63.25,22.73 v61.85,24.13 | C5.+ 73.28,22.73 | 132.08,11.21 132.08,10.03 128.78,6.73 122.94,6.73 120.27,6.73 | 120.27,6.73 109.6,6.73 | 109.6,6.73 98.93,6.73 | JP5.2 98.93,6.73 | JP1.2 109.6,6.73 | JP2.2 120.27,6.73
  other vias: 61.85,25.65 59.05,25.65 60.58,24.13 61.85,22.61 59.05,22.61 59.05,24.13 60.58,25.65
  pour Bottom (isolate 0.508, rank 2, no thermals): 77.98,21.72 77.98,20.32 75.06,20.32 74.42,19.69 74.42,19.18 72.14,19.18 72.14,21.72
  pour Top (isolate 0.508, no thermals): 58.67,21.84 58.67,26.16 63.37,26.16 68.45,21.08 68.45,18.16 62.99,18.16 62.99,19.18 60.32,21.84
  pour Bottom (isolate 0.508, no thermals): 58.55,26.29 58.55,21.84 62.36,21.84 62.36,26.29 58.67,26.29
+12V
  Top 0.508: R24.2 56.01,1.78 57.98,3.75 C16.+
  pour Top (isolate 0.508, no thermals): 59.05,12.32 59.05,6.6 59.94,5.71 63.37,5.71 63.37,1.91 56.13,1.91 56.13,11.56 56.9,12.32
-12V  (via drill 0.61)
  other vias: 45.47,8.64 48.51,8.64 46.99,7.11 45.47,5.59 48.51,5.59 46.99,4.06 48.51,4.06 45.47,4.06 46.99,5.59 48.51,7.11 45.47,7.11 46.99,8.64 50.04,8.64 53.09,8.64 51.56,7.11 50.04,5.59 53.09,5.59 51.56,4.06 53.09,4.06 50.04,4.06 51.56,5.59 53.09,7.11 50.04,7.11 51.56,8.64 52.7,22.48 52.7,25.53 54.23,24 54.23,25.53 54.23,22.48 52.7,24 53.97,13.59 53.97,10.54 53.97,12.06 51.18,22.48 51.18,25.53 51.18,24 46.99,11.43 46.99,14.48 48.51,12.95 50.04,11.43 50.04,14.48 51.56,12.95 51.56,14.48 51.56,11.43 50.04,12.95 48.51,14.48 48.51,11.43 46.99,12.95 46.99,16 46.99,19.05 48.51,17.53 50.04,16 50.04,19.05 51.56,17.53 51.56,19.05 51.56,16 50.04,17.53 48.51,19.05 48.51,16 46.99,17.53
  pour Top (isolate 0.508, rank 5, no thermals): 59.18,14.73 56.9,14.73 54.86,12.7 54.86,2.54 43.81,2.54 43.81,26.16 54.86,26.16 54.86,19.18 59.18,19.18
  pour Bottom (isolate 0.762, rank 5, no thermals): 58.93,7.24 70.48,7.24 74.8,11.56 85.98,11.56 89.15,8.38 89.15,-0.76 84.33,-0.76 84.33,5.46 83.31,6.48 79.88,6.48 72.64,-0.76 43.69,-0.76 43.69,26.16 54.99,26.16 54.99,19.56 55.12,19.56 55.12,14.86 56.01,13.97 56.01,10.16
ADC12_IN1  (via drill 0.61)
  Top 0.254: R23.2 v42.04,5.84 | STM.24 74.02,39.75 68.58,39.75 | 68.58,39.75 64.01,39.75 63.25,38.99 63.25,30.73 61.98,29.46 45.85,29.46 42.54,32.77 38.48,32.77 v37.34,31.62 | v68.58,39.37 68.58,39.75
  Bottom 0.254: C7.2 v68.58,39.37 | v37.34,31.62 37.34,10.54 v42.04,5.84
ADC123_IN10  (via drill 0.61)
  Top 0.254: 75.56,44.58 | 75.56,44.58 70.61,44.58 v68.71,46.48 67.69,46.48 65.66,48.51 65.66,59.18 v67.18,60.71 | STM.15 75.56,44.58
  Bottom 0.254: U2.V2 155.7,49.91 144.53,61.09 67.56,61.09 v67.18,60.71 | v68.71,46.48 C31.1
ADC123_IN11  (via drill 0.61)
  Top 0.254: 75.36,44.07 | 75.36,44.07 69.34,44.07 v68.71,44.7 67.69,44.7 65.15,47.24 65.15,60.2 v65.66,60.71 | STM.16 75.36,44.07
  Bottom 0.254: U2.H2 148.84,61.59 66.55,61.59 v65.66,60.71 | C32.1 v68.71,44.7
ADC123_IN12  (via drill 0.61)
  Top 0.254: 75.16,43.56 | 75.16,43.56 69.34,43.56 v68.71,42.93 67.69,42.93 64.64,45.97 64.64,59.69 v63.63,60.71 | STM.17 75.16,43.56
  Bottom 0.254: C28.1 v68.71,42.93 | U3.H2 19.69,58.67 21.34,58.67 24.26,61.59 62.74,61.59 v63.63,60.71
ADC123_IN13  (via drill 0.61)
  Top 0.254: 74.96,43.05 | 74.96,43.05 70.61,43.05 v68.71,41.15 67.69,41.15 64.14,44.7 64.14,58.67 v62.1,60.71 | STM.18 74.96,43.05
  Bottom 0.254: C30.1 v68.71,41.15 | v62.1,60.71 61.72,61.09 27.94,61.09 24.13,57.28 24.13,54.23 U3.V2
BOOT0
  Top 0.254: STM.94 89.96,47.03 90.17,47.24 90.42,47.5 R7.2
BOOT1
  Top 0.254: STM.37 75.12,28.66 R8.2
BT_KEY  (via drill 0.61)
  Top 0.254: STM.97 88.27,47.46 88.27,54.48 v85.6,57.15 | 60.45,51.82 U1.34 61.21,51.82 61.85,52.45 v61.85,58.04
  Bottom 0.254: v85.6,57.15 85.09,57.66 79.88,57.66 77.47,60.07 71.5,60.07 70.48,59.05 62.86,59.05 v61.85,58.04
BT_POWER
  Top 0.254: STM.25 71.12,38.6 | 70.23,38.6 70.74,38.6 | 70.74,38.6 71.12,38.6 | 71.12,38.6 71.12,38.61 | 70.74,38.6 70.73,38.61 70.1,38.61 69.56,38.06 R35.2
BT_STATE  (via drill 0.61)
  Top 0.254: STM.98 87.76,47.66 87.76,53.21 v84.2,56.77 | v62.74,57.02 62.74,38.23 61.34,36.83 60.38,36.83 U1.24
  Bottom 0.254: v84.2,56.77 80.01,56.77 77.22,59.56 71.76,59.56 70.74,58.55 64.26,58.55 v62.74,57.02
BUTTON_L_DOWN
  Top 0.254: STM.32 69.85,26.92 49.4,26.92 42.54,20.07 34.04,20.07 S4.1
BUTTON_L_JOYSTICK
  Top 0.254: STM.26 73.11,35.77 66.29,28.96 43.94,28.96 42.67,30.23 28.45,30.23 U3.B1A
  Bottom 0.254: C27.1 19.5,39.18 U3.B1A
BUTTON_L_LEFT
  Top 0.254: S8.1 21.49,11.33 32.77,22.61 42.54,22.61 47.37,27.43 69.65,27.43 STM.31
BUTTON_L_RIGHT
  Top 0.254: STM.29 69.25,28.45 43.43,28.45 42.67,27.69 29.13,27.69 S7.1
BUTTON_L_UP
  Top 0.254: STM.30 69.45,27.94 45.47,27.94 42.67,25.15 30.48,25.15 27.3,21.97 16.64,21.97 S1.3
BUTTON_R_DOWN
  Top 0.254: STM.33 72.39,28.76 72.39,20.57 84.71,8.25 147.07,8.25 153.92,8.25 154.05,8.38 S2.1
BUTTON_R_JOYSTICK
  Top 0.254: STM.91 94.74,49.7 94.74,59.05 97.79,62.1 141.1,62.1 150.5,52.7 150.5,40.26 U2.B1A
  Bottom 0.254: C29.1 151.45,39.69 151.76,39.37 151.76,38.99 U2.B1A
BUTTON_R_LEFT
  Top 0.254: STM.36 73.91,28.16 73.91,21.34 85.47,9.78 130.17,9.78 144.17,23.77 S3.1
BUTTON_R_RIGHT
  Top 0.254: STM.34 72.9,28.56 72.9,20.83 84.96,8.76 144.14,8.76 153.69,18.31 S5.3
BUTTON_R_UP
  Top 0.254: STM.35 73.41,28.36 73.41,21.08 85.22,9.27 141.43,9.27 S6.1
CH1  (via drill 0.61)
  Top 0.254: R11.1 v103.63,39.75 | v112.27,49.53 120.02,49.53 125.48,54.99 130.81,54.99 132.33,53.47 132.33,36.07 135.57,32.83 135.66,32.74 U$13.B+
  Bottom 0.254: v112.27,49.53 111,49.53 107.06,45.59 107.06,41.91 105.66,40.51 104.39,40.51 v103.63,39.75 | JP2.1 128.02,4.45 140.33,16.76 140.33,29.02 U$13.B+
  other vias: 136.61,32.74
CH2  (via drill 0.61)
  Top 0.254: R39.1 101.6,39.12 v102.23,39.75 | v113.54,50.42 120.14,50.42 125.22,55.5 131.06,55.5 132.84,53.72 132.84,37.34 135.64,34.54 136.27,34.54 U$13.G+
  Bottom 0.254: v113.54,50.42 111.12,50.42 106.55,45.85 106.55,42.16 105.41,41.02 103.51,41.02 v102.23,39.75 | JP1.1 114.05,2.54 126.87,2.54 140.84,16.51 140.84,30.31 U$13.G+
  other vias: 136.61,34.54
CH3  (via drill 0.61)
  Top 0.254: R12.2 99.57,38.48 v100.84,39.75 | v114.94,51.31 120.27,51.31 124.97,56.01 131.32,56.01 133.35,53.97 133.35,38.61 135.61,36.34 136.02,36.34 U$13.R+
  Bottom 0.254: v114.94,51.31 111.25,51.31 106.05,46.1 106.05,42.42 105.16,41.53 102.62,41.53 v100.84,39.75 | JP5.1 103.89,2.03 127.13,2.03 141.35,16.26 141.35,31.6 U$13.R+
  other vias: 136.61,36.34
GND  (via drill 0.61)
  Top 0.254: STM.27 75.97,36.58 77.6,36.58 77.6,36.57 v78.11,36.07 | 77.48,39.12 78.36,39.12 | 92.88,36.45 | v91.69,36.07 92.08,36.45 92.88,36.45 | IC1.11 73.9,55.86 73.66,55.63 73.66,54.61 | IC1.18 77.97,53.37 C38.2 | 77.98,38.62 v77.98,38.61 | STM.74 92.88,36.45 | STM.10 80.74,42.93 81.54,42.93 v81.79,43.18 | v79.38,38.61 v77.99,38.61 STM.20 | STM.99 85.34,45.95 | 85.34,45.95 85.09,45.7 85.09,45.09 85.34,45.34 85.34,45.95 | IC1.1 77.97,59.55 78.11,59.69 | IC1.9 71.51,56.9 71.5,56.9 | STM.99 86.87,47.48 86.87,48.51 | STM.99 86.25,46.86
  Top 0.762: C19.2 97.47,36.39 97.28,36.58
  other vias: 97.43,16 97.43,18.54 94.77,16.64 84.48,26.05 75.06,24.42 78.61,47.75 71.25,46.1 71.37,41.4 71.5,32.38 91.31,57.4 103.12,53.34 103.12,54.73 79.25,35.05 80.39,34.03 81.66,33.02 82.93,32 82.93,35.94 81.66,35.05 80.39,35.94 82.93,34.04 80.9,38.48 82.8,38.48 90.12,34.5 87.34,31.71 88.68,33.06 88.43,34.84 87.16,33.57 89.66,36.07 85.73,36.07 87.63,36.07 85.73,30.22 85.73,34.16 85.73,32.26 83.06,43.18 85.6,44.45 87.17,42.88 89.95,40.09 88.61,41.44 86.83,41.19 88.1,39.92 85.6,42.42 85.6,38.48 85.6,40.39 87.51,38.48 89.41,38.48 70.99,36.07 90.42,50.55 83.82,52.2 80.9,47.75 78.61,50.42 78.87,54.23 70.99,56.9 69.47,55.63 71.12,37.46 62.1,33.66 46.99,33.02 46.23,31.62 107.31,56 90.42,52.32 93.34,57.4 93.34,50.04 70.99,54.35 73.91,54.23 80.52,52.83 78.87,52.83 83.82,53.72 108.33,36.58 108.33,30.73 108.33,34.67 108.33,32.77 108.33,38.61 110.58,31.71 112.02,33.15 100.2,15.64 100.2,19.07 100.2,17.42 79.76,46.48 79.76,49.02 80.9,50.42 60.71,33.66 64.52,38.61 70.23,31.24 60.71,31.88 102.36,58.54 101.85,54.73 115.87,42.22 120.01,46.35 117.22,43.56 118.57,44.91 114.44,40.78 97.41,35.43 97.41,37.46 107.31,57.53 91.32,38.48 95.38,37.97 64.52,37.08 64.14,40.89 84.58,24.26 88.42,15.62 87.25,16.64 86.23,24.26 41.91,3.81 44.96,32.77 62.1,31.88
  pour Bottom (isolate 0.508, rank 6, no thermals): -0.25,63.37 -0.25,-5.59 168.91,-5.59 168.91,63.37
  pour Top (isolate 0.508, rank 6, no thermals): 168.91,-0.25 90.3,-0.25 90.3,8 85.34,8 67.06,26.29 43.56,26.29 43.56,-0.25 -0.25,-0.25 -0.25,65.41 45.34,65.41 45.34,34.16 60.2,34.16 60.2,65.15 168.91,65.41
I2C1_SCL
  Top 0.254: STM.95 89.28,47.06 89.28,55.63 89.28,56.13 85.98,59.44 85.22,59.44 83.19,57.4 80.81,57.4 | IC1.23 80.81,57.4 | R5.1 80.81,57.4
I2C1_SDA  (via drill 0.61)
  Top 0.254: STM.96 88.77,47.26 88.77,54.86 88.77,55.37 v85.6,58.55 | IC1.24 79.63,57.91 v80.26,58.55 R6.1
  Bottom 0.254: v85.6,58.55 v80.26,58.55
I2C2_SCL
  Top 0.254: R15.2 96.04,21.34 95.53,20.83 95.53,18.8 94.64,17.91 IC2.6 84.96,17.91 80.9,21.97 80.9,27.37 STM.47
I2C2_SDA
  Top 0.254: 93.31,19.3 IC2.5 | IC2.5 93.47,19.18 94.11,19.18 | STM.48 81.4,27.16 81.4,22.23 84.2,19.43 84.33,19.3 85.22,18.42 91.06,18.42 91.82,19.18 IC2.5 | 93.85,19.18 94.11,19.18 | R16.1 94.35,19.42 94.11,19.18
N$1
  Top 0.254: STM.12 76.45,45.8 Y1.2
  Bottom 0.254: 76.86,50.06 Y1.2 77.41,50.61 C1.1
N$2
  Top 0.254: S8.2 2.57,21.98 C6.2
N$3
  Top 0.254: 72.64,55.88 C23.1 73.09,56.36 IC1.10
N$4
  Top 0.254: IC1.20 79.77,55.86 80.39,55.24 C36.1
N$5
  Top 0.254: S6.2 134.64,22.09 C22.2
N$6
  Top 0.254: S7.2 34.01,13.06 C35.1
N$7
  Top 0.254: S5.4 164.39,11.33 C25.1
N$8  (via drill 0.61)
  Top 0.254: R10.2 37,33.69 38.61,35.31 44.2,35.31 | 44.2,35.31 45.28,35.31 C4.2 45.39,35.32 U1.12 | 44.2,35.31 43.43,34.54 43.43,32.64 45.72,30.35 v61.47,30.35 | LN2302LT1G.2 64.9,30.99 v64.26,30.35
  Bottom 0.254: v64.26,30.35 v61.47,30.35
N$9
  Top 0.254: S2.2 145.9,2.06 C24.1
N$10
  Top 0.254: S3.2 154.84,33.38 C26.1
N$11
  Top 0.254: R37.2 67.99,35.39 LN2302LT1G.3
N$12
  Top 0.254: S1.4 24.49,31.6 C34.1
N$13
  Top 0.254: S4.2 13.79,1.68 C33.1
N$14
  Top 0.254: LD1.A R9.2
N$15
  Top 0.254: 31.62,35.59 R10.1 31.42,35.59 LD2.A
N$27
  Top 0.254: R23.1 39.79,4.06 R25.2 R24.1
N$29
  Top 0.254: STM.13 71.89,49.66 Y1.1
  Bottom 0.254: C20.1 70.42,50.61 Y1.1
N$31
  Top 0.254: STM.73 94.2,34.42 C17.1
N$32
  Top 0.254: STM.49 81.92,26.97 81.92,24.14 C15.1
N$34
  Top 0.254: R35.1 R36.2 66.26,36.81 LN2302LT1G.1
OUT1  (via drill 0.61)
  other vias: 67.95,13.59 67.95,10.79 66.55,12.19 65.15,13.59 65.15,10.79 63.75,12.19 62.36,13.59 62.36,10.79 60.96,12.19 60.96,10.79 60.96,13.59 62.36,12.19 63.75,10.79 63.75,13.59 65.15,12.19 66.55,10.79 66.55,13.59 67.95,12.19
  pour Top (isolate 0.508, no thermals): 57.02,13.97 59.05,13.97 68.45,14.1 68.45,7.62 63.12,7.62 60.58,10.16 60.58,12.19 59.69,13.08 57.02,13.08
  pour Bottom (rank 5, no thermals): 60.45,10.03 60.45,14.1 68.45,14.1 68.45,10.03
SDIO_CLK  (via drill 0.61)
  Top 0.254: v97.92,43.05 97.54,42.67 95.5,42.67 STM.80 | v97.92,49.66 95.25,52.32 95.25,58.04 96.65,59.44 100.46,59.44 101.12,58.77 SDCARD2.5
  Bottom 0.254: v97.92,43.05 v97.92,49.66
SDIO_CMD  (via drill 0.61)
  Top 0.254: SDCARD2.3 98.92,56.01 101.73,53.2 v101.73,49.66 | STM.83 95.79,45.09 100.2,45.09 v101.73,46.61
  Bottom 0.254: v101.73,46.61 v101.73,49.66
SDIO_D0  (via drill 0.61)
  Top 0.254: SDCARD2.7 103.32,57.6 103.63,57.91 105.16,57.91 105.54,57.53 105.54,50.67 v104.52,49.66 | STM.65 92.48,30.48 101.73,30.48 105.03,33.78 105.03,42.54 v104.52,43.05
  Bottom 0.254: v104.52,43.05 v104.52,49.66
SDIO_D1  (via drill 0.61)
  Top 0.254: STM.66 92.68,30.99 101.47,30.99 104.52,34.04 104.52,41.66 v103.12,43.05 | SDCARD2.8 104.42,50.96 v103.12,49.66
  Bottom 0.254: v103.12,43.05 v103.12,49.66
SDIO_D2  (via drill 0.61)
  Top 0.254: v100.71,43.05 99.31,41.66 95.9,41.66 STM.78 | v100.71,50.67 96.72,54.66 SDCARD2.1
  Bottom 0.254: v100.71,43.05 v100.71,50.67
SDIO_D3  (via drill 0.61)
  Top 0.254: SDCARD2.2 97.82,57.5 97.28,58.04 96.39,58.04 95.76,57.4 95.76,53.21 v99.31,49.66 | v99.31,43.05 98.43,42.16 95.7,42.16 STM.79
  Bottom 0.254: v99.31,43.05 v99.31,49.66
SDIO_DETECT
  Top 0.254: STM.84 96.37,46.37 SDCARD2.CD2
SW-!RESET  (via drill 0.61)
  Top 0.254: C13.1 74.74,46.1 STM.14 73.21,47.62 69.98,47.62 67.82,49.78 67.82,59.82 69.22,61.21 83.06,61.21 v84.07,60.2 | 108.46,56.9 JP4.5 | v101.47,60.2 102.87,61.59 107.57,61.59 108.46,60.71 108.46,58.04 108.46,56.9 | S9.P$2 108.46,56.9
  Bottom 0.254: v101.47,60.2 v84.07,60.2
SW_CLK  (via drill 0.61)
  Top 0.254: STM.76 95.4,39.75 v97.92,39.75
  Bottom 0.254: v97.92,39.75 98.93,38.73 104.65,38.73 107.57,41.66 107.57,45.34 110.87,48.64 113.67,48.64 116.08,51.05 JP4.2
SW_DIO  (via drill 0.61)
  Top 0.254: STM.72 94.89,33.02 98.04,33.02 98.68,33.66 98.68,38.99 v99.44,39.75
  Bottom 0.254: JP4.4 111,51.82 105.54,46.35 105.54,42.67 104.9,42.04 101.73,42.04 v99.44,39.75
TFT_BACKLIGHT
  Top 0.254: U$3.27 128.18,45.47 126.11,45.47 108.2,27.56 93.6,27.56 92.88,27.56 91.87,27.56 STM.60
TFT_CS
  Top 0.254: U$3.19 131.83,36.48 131.83,53.21 130.56,54.48 125.73,54.48 119.89,48.64 95.81,48.64 STM.88
TFT_D0  (via drill 0.61)
  Top 0.254: STM.61 90.67,29.46 101.85,29.46 v102.74,28.58
  Bottom 0.254: U$3.3 128.23,12.57 111.38,12.57 102.74,21.21 v102.74,28.58
TFT_D1  (via drill 0.61)
  Top 0.254: STM.62 90.87,29.97 102.74,29.97 v104.14,28.58
  Bottom 0.254: v104.14,28.58 104.14,21.72 112.11,13.75 U$3.4
TFT_D2  (via drill 0.61)
  Top 0.254: STM.81 96.19,44.07 105.03,44.07 105.54,43.56 v105.54,28.58
  Bottom 0.254: U$3.5 128.11,14.99 112.65,14.99 105.54,22.1 v105.54,28.58
TFT_D3  (via drill 0.61)
  Top 0.254: STM.82 95.99,44.58 105.41,44.58 106.93,43.05 v106.93,28.58
  Bottom 0.254: v106.93,28.58 106.93,22.73 113.38,16.29 U$3.6
TFT_D4
  Top 0.254: U$3.7 128.11,17.53 122.05,17.53 117.79,13.27 114.94,10.41 114.81,10.29 85.73,10.29 76.33,19.69 76.33,29.16 STM.38
TFT_D5
  Top 0.254: STM.39 76.84,28.96 76.84,19.94 85.98,10.79 114.55,10.79 114.68,10.92 115.89,12.13 122.56,18.8 126.84,18.8 U$3.8
TFT_D6
  Top 0.254: U$3.9 128.11,20.07 123.06,20.07 118.3,15.3 114.43,11.43 114.3,11.3 86.23,11.3 77.34,20.19 77.34,28.76 STM.40
TFT_D7
  Top 0.254: STM.41 77.85,28.56 77.85,20.45 86.49,11.81 114.05,11.81 114.17,11.94 119.63,17.4 123.57,21.34 126.84,21.34 U$3.10 126.87,21.46
TFT_D8
  Top 0.254: U$3.11 128.11,22.61 124.08,22.61 118.17,16.7 113.92,12.45 113.79,12.32 86.74,12.32 78.36,20.7 78.36,28.36 STM.42
TFT_D9
  Top 0.254: STM.43 78.87,28.16 78.87,20.96 87,12.83 113.54,12.83 113.67,12.95 117.6,16.89 124.59,23.88 126.84,23.88 U$3.12
TFT_D10
  Top 0.254: U$3.13 128.11,25.15 125.09,25.15 117.6,17.65 113.41,13.46 113.28,13.33 87.25,13.33 79.38,21.21 79.38,27.96 STM.44
TFT_D11
  Top 0.254: STM.45 79.88,27.77 79.88,21.46 87.5,13.84 113.03,13.84 113.16,13.97 117.09,17.91 125.6,26.42 126.84,26.42 U$3.14
TFT_D12
  Top 0.254: U$3.15 128.11,27.69 126.11,27.69 117.41,18.99 112.9,14.48 112.78,14.35 87.76,14.35 80.39,21.72 80.39,27.57 STM.46
TFT_D13
  Top 0.254: U$3.16 113.45,28.99 109.47,25.02 92.46,25.02 91.89,25.02 90.87,25.02 STM.55
TFT_D14
  Top 0.254: U$3.17 128.11,30.23 113.92,30.23 109.22,25.53 92.33,25.53 92.09,25.53 91.07,25.53 STM.56
TFT_D15
  Top 0.254: U$3.18 114.46,31.53 108.97,26.04 92.96,26.04 92.29,26.04 91.27,26.04 STM.57
TFT_RD
  Top 0.254: U$3.22 128.11,37.85 130.17,37.85 130.81,38.48 130.81,52.7 130.05,53.47 126.25,53.47 120.41,47.62 96.91,47.62 STM.85
TFT_RS
  Top 0.254: U$3.20 116.24,34.07 108.71,26.54 92.96,26.54 92.48,26.54 91.47,26.54 STM.58
TFT_WR
  Top 0.254: U$3.21 129.45,36.58 130.17,36.58 131.32,37.72 131.32,52.96 130.3,53.97 125.98,53.97 120.14,48.13 96.72,48.13 STM.86
TIM1_CH1
  Top 0.254: STM.67 92.88,31.5 101.22,31.5 103.63,33.91 R11.2
TIM1_CH2
  Top 0.254: STM.68 93.08,32 99.7,32 101.6,33.91 R39.2
TIM1_CH3
  Top 0.254: STM.69 93.28,32.51 98.3,32.51 99.57,33.78 R12.1
TP_CS  (via drill 0.61)
  Top 0.254: v118.24,28.07 113.16,22.99 94.49,22.99 91.09,22.99 90.07,22.99 STM.51
  Bottom 0.254: U$3.29 128.11,45.47 126.11,45.47 118.24,37.59 v118.24,28.07
TP_IQR
  Top 0.254: U$3.28 126.15,44.23 126.11,44.2 125.6,44.2 108.46,27.05 92.96,27.05 92.68,27.05 91.67,27.05 STM.59
TP_SCK  (via drill 0.61)
  Top 0.254: v116.84,28.07 112.27,23.5 93.09,23.5 91.29,23.5 90.27,23.5 STM.52
  Bottom 0.254: U$3.30 126.15,46.77 116.84,37.46 v116.84,28.07
TP_SI  (via drill 0.61)
  Top 0.254: v114.05,28.07 110.49,24.51 92.2,24.51 91.69,24.51 90.67,24.51 STM.54
  Bottom 0.254: 129.41,49.27 U$3.31 128.18,50.55 126.11,50.55 114.05,38.48 v114.05,28.07
TP_SO  (via drill 0.61)
  Top 0.254: v115.44,28.07 111.38,24 92.33,24 91.49,24 90.47,24 STM.53
  Bottom 0.254: v115.44,28.07 115.44,38.61 126.15,49.31 U$3.32
USART1_RX
  Top 0.254: STM.93 91.69,48.06 91.69,54.48 84.45,61.72 46.48,61.72 45.47,60.71 45.47,51.82 U1.1
USART1_TX
  Top 0.254: STM.92 92.2,47.86 92.2,54.74 84.71,62.23 46.23,62.23 44.96,60.96 44.96,50.8 45.44,50.32 U1.2
VCC
  pour Top (isolate 0.762, rank 5, no thermals): 68.07,5.59 83.44,5.59 83.44,2.16 68.07,2.16

### Text on the board
Top: V1.0 | VND Play
Bottom: vnd241092@gmail.com
tNames: RST | DIO | 5V | CLK | GND | BOOT0 | BOOT1 | Rb | Rt | CH3 | CH2 | CH1